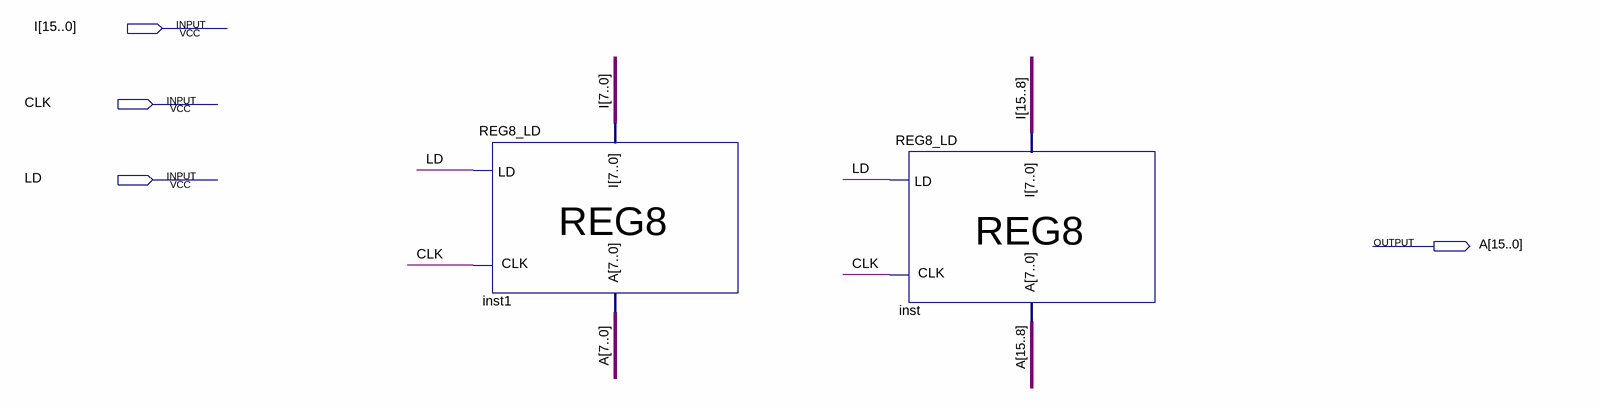
[diagram p0: schematic sheet]
// Quartus schematic REG16_LD.bdf as structural Verilog: 2 symbols, 4 pins
module REG16_LD (
  input  [15:0] I,
  input  CLK,
  input  LD,
  output [15:0] A
);

  REG8_LD inst1 (.I(I[7:0]), .CLK(CLK), .LD(LD), .A(A[7:0]));
  REG8_LD inst (.I(I[15:8]), .CLK(CLK), .LD(LD), .A(A[15:8]));
endmodule
